# EasyEDA schematic microbit-v2-smart-robot-schematic-2023-03-23.json
TITLE: microbit-v2-smart-robot; REV: 1.0; Date: 2023-03-23; Sheet: 1/1; Drawn By: professor_zia; Company: CET
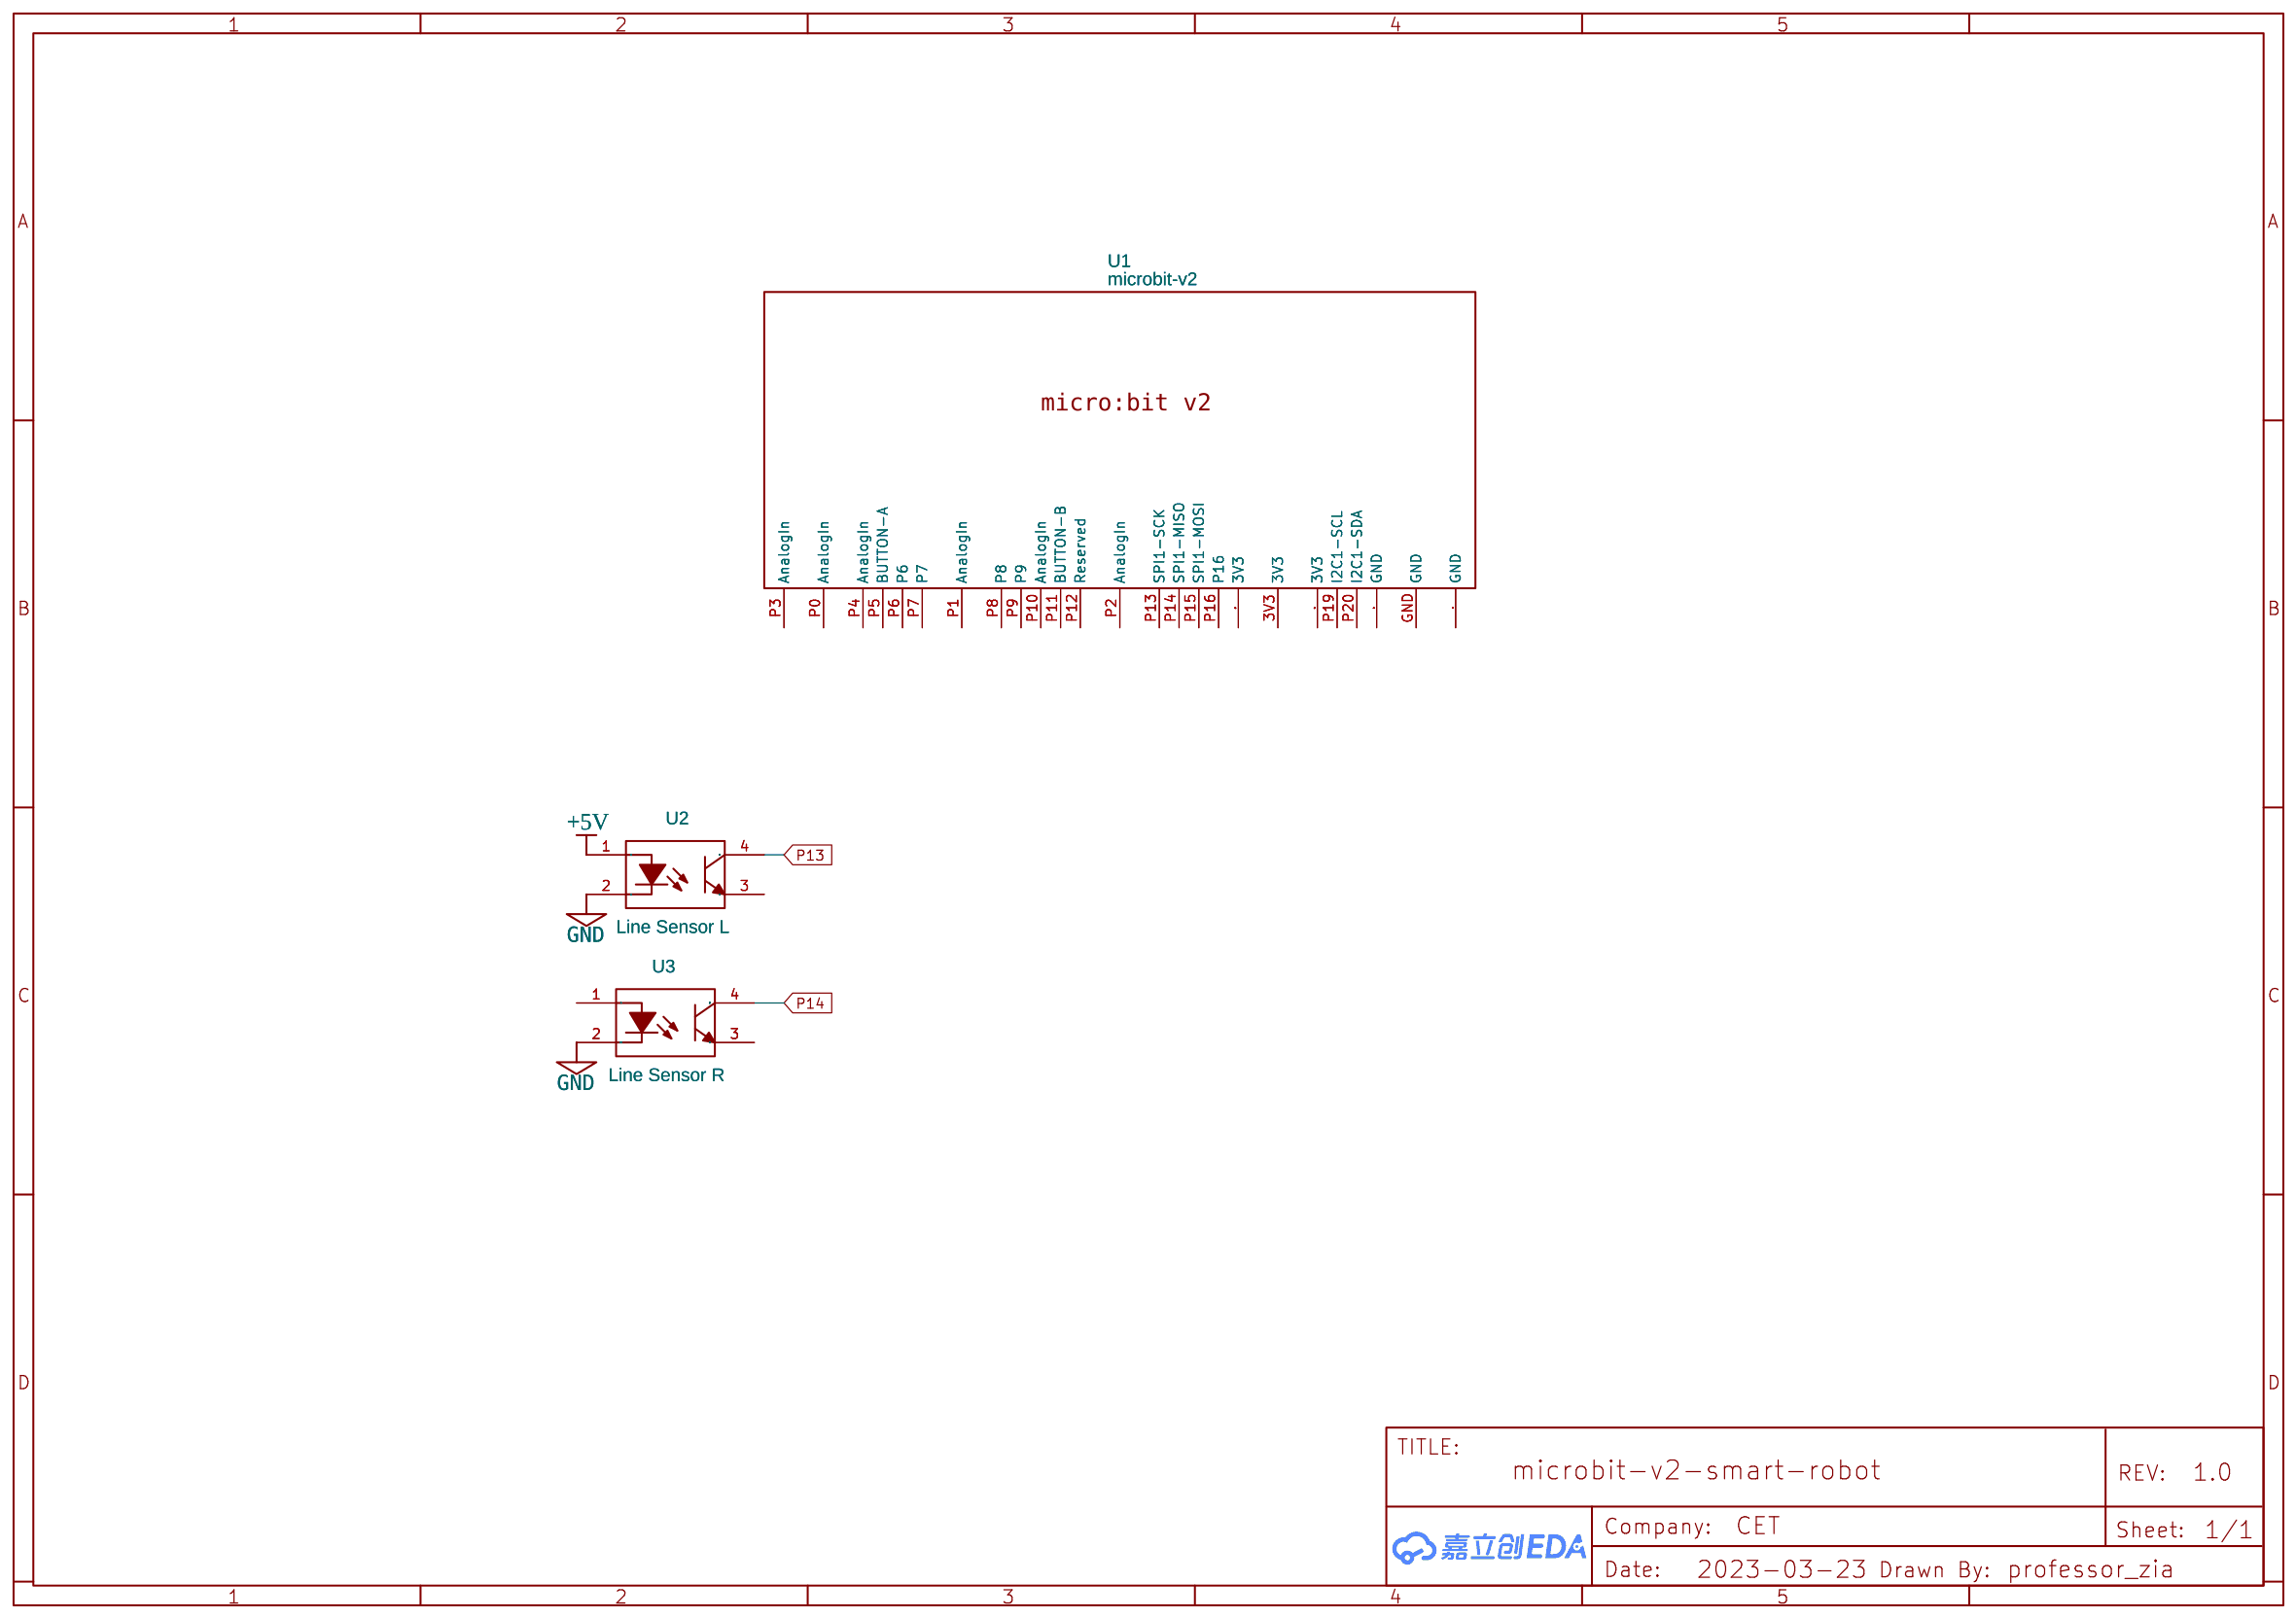
[diagram p0: schematic sheet]

## Parts
U1  microbit-v2
U2  Line Sensor L  [SOP-4_L4.4-W2.8-P1.27-LS7.0-BR]
U3  Line Sensor R  [SOP-4_L4.4-W2.8-P1.27-LS7.0-BR]

## Library data of the parts
U1 = microbit-v2: Contributor: professor_zia
U2 U3 = TLP291(GB-TP,SE(O: Supplier: LCSC; Supplier Part: C393895; Manufacturer: TOSHIBA; Contributor: LCSC; JLCPCB Part Class: Extended Part

## Nets
+5V: U2.1(AN)
GND: U2.2(CAT) U3.2(CAT)
P13: U2.4(COL)
P14: U3.4(COL)

Not connected (* = marked no-connect by the designer): U1 3V3 3Va(3V3) 3Vb(3V3) Ga(GND) Gb(GND) GND P0(AnalogIn) P1(AnalogIn) P2(AnalogIn) P3(AnalogIn) P4(AnalogIn) P5(BUTTON-A) P6 P7 P8 P9 P10(AnalogIn) P11(BUTTON-B) P12(Reserved) P13(SPI1-SCK) P14(SPI1-MISO) P15(SPI1-MOSI) P16 P19(I2C1-SCL) P20(I2C1-SDA); U2 3(EM); U3 1(AN) 3(EM)
